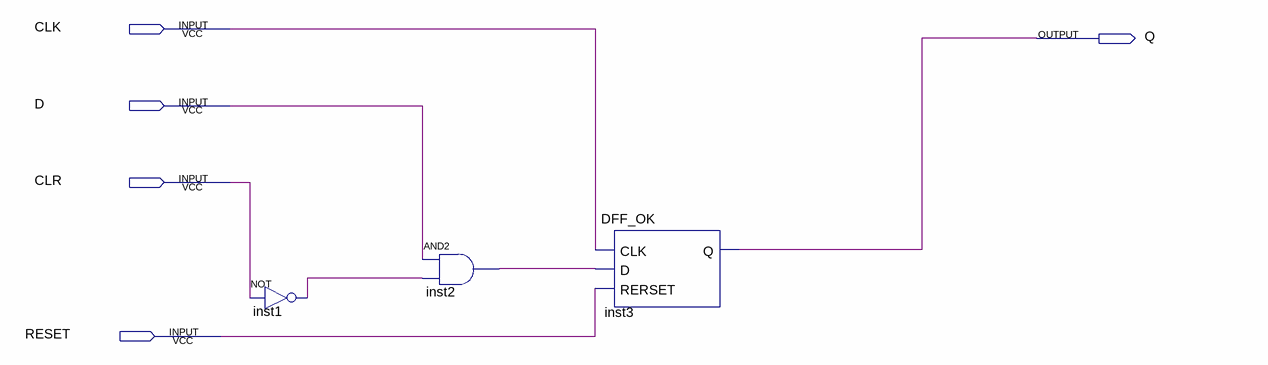
[diagram p0: schematic sheet]
// Quartus schematic DFFwithCLR.bdf as structural Verilog: 3 symbols, 5 pins
module DFFwithCLR (
  input  CLK,
  input  D,
  input  CLR,
  input  RESET,
  output Q
);

  wire inst1_out, inst2_out;

  not inst1 (inst1_out, CLR);
  and inst2 (inst2_out, D, inst1_out);
  DFF_OK inst3 (.CLK(CLK), .D(inst2_out), .RERSET(RESET), .Q(Q));
endmodule
